# Altium schematic sheet POWER.SchDoc
size A2; SheetNumber: 1; SheetTotal: 6; SPICEModelCacheZVIZADMF: <root> / <DocumentId>ZVIZADMF</DocumentId> / </root>
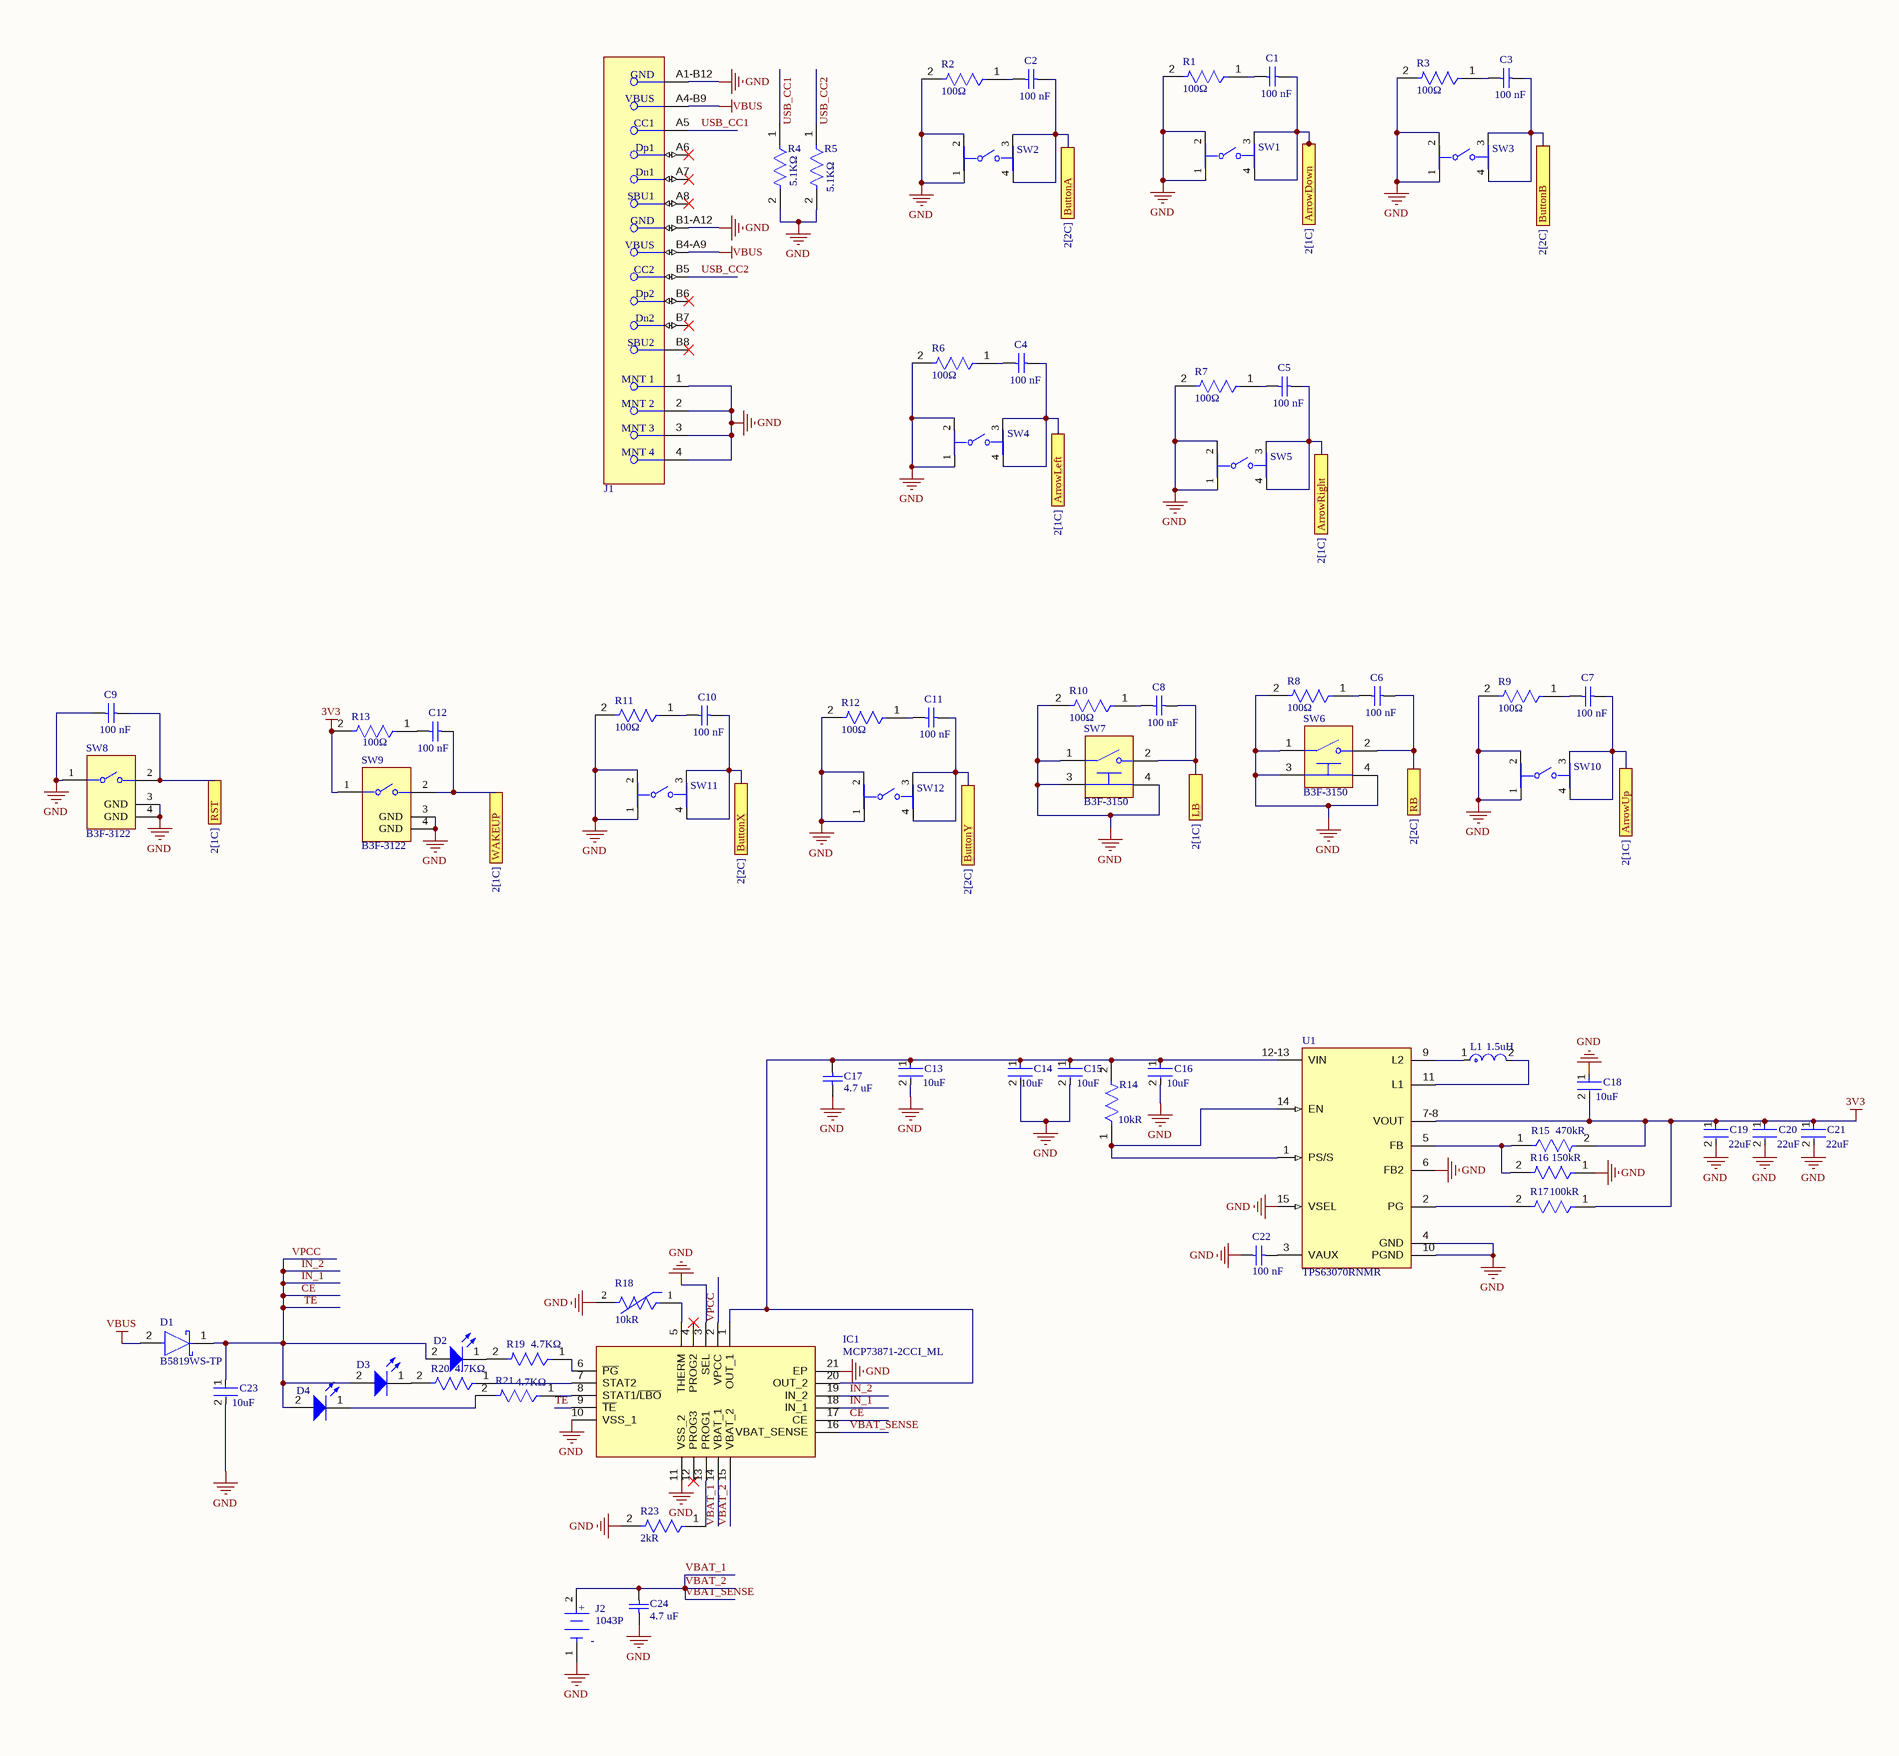
[diagram p0: POWER.SchDoc, left]
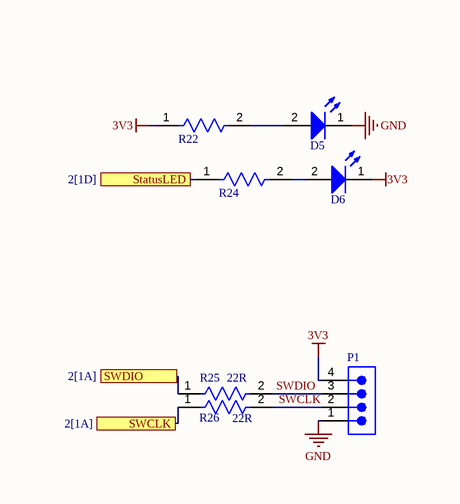
[diagram p1: POWER.SchDoc, right]

## Parts
C1  value 100 nF  [CAPC2013X145X50LL20T25]  (hidden comment: C0805C104K9RACTU)
C2  value 100 nF  [CAPC2013X145X50LL20T25]  (hidden comment: C0805C104K9RACTU)
C3  value 100 nF  [CAPC2013X145X50LL20T25]  (hidden comment: C0805C104K9RACTU)
C4  value 100 nF  [CAPC2013X145X50LL20T25]  (hidden comment: C0805C104K9RACTU)
C5  value 100 nF  [CAPC2013X145X50LL20T25]  (hidden comment: C0805C104K9RACTU)
C6  value 100 nF  [CAPC2013X145X50LL20T25]  (hidden comment: C0805C104K9RACTU)
C7  value 100 nF  [CAPC2013X145X50LL20T25]  (hidden comment: C0805C104K9RACTU)
C8  value 100 nF  [CAPC2013X145X50LL20T25]  (hidden comment: C0805C104K9RACTU)
C9  value 100 nF  [CAPC2013X145X50LL20T25]  (hidden comment: C0805C104K9RACTU)
C10  value 100 nF  [CAPC2013X145X50LL20T25]  (hidden comment: C0805C104K9RACTU)
C11  value 100 nF  [CAPC2013X145X50LL20T25]  (hidden comment: C0805C104K9RACTU)
C12  value 100 nF  [CAPC2013X145X50LL20T25]  (hidden comment: C0805C104K9RACTU)
C13  Capacitance: 10uF  [FP-CL21-IPC_C]  (hidden comment: CL21A106MPFNNNF)
C14  Capacitance: 10uF  [FP-CL21-IPC_C]  (hidden comment: CL21A106MPFNNNF)
C15  Capacitance: 10uF  [FP-CL21-IPC_C]  (hidden comment: CL21A106MPFNNNF)
C16  Capacitance: 10uF  [FP-CL21-IPC_C]  (hidden comment: CL21A106MPFNNNF)
C17  value 4.7 uF  [CAPC2013X145X50NL20T25]  (hidden comment: C0805C475K9PACTU)
C18  Capacitance: 10uF  [FP-CL21-IPC_C]  (hidden comment: CL21A106MPFNNNF)
C19  Capacitance: 22uF  [FP-CL21-IPC_B]  (hidden comment: CL21A226MQCLQNC)
C20  Capacitance: 22uF  [FP-CL21-IPC_B]  (hidden comment: CL21A226MQCLQNC)
C21  Capacitance: 22uF  [FP-CL21-IPC_B]  (hidden comment: CL21A226MQCLQNC)
C22  value 100 nF  [CAPC1005X56X25LL10T15]  (hidden comment: 0402ZD104JAT2A)
C23  Capacitance: 10uF  [FP-CL21-IPC_C]  (hidden comment: CL21A106MPFNNNF)
C24  value 4.7 uF  [CAPC2013X145X50NL20T25]  (hidden comment: C0805C475K9PACTU)
D1  B5819WS-TP  [FP-SOD-323-IPC_C]
D2  150080BS75000  [WL-SMCW_0805_150080xx75000]  (value not drawn)
D3  150080BS75000  [WL-SMCW_0805_150080xx75000]  (value not drawn)
D4  150080BS75000  [WL-SMCW_0805_150080xx75000]  (value not drawn)
D5  150080BS75000  [WL-SMCW_0805_150080xx75000]  (value not drawn)
D6  150080BS75000  [WL-SMCW_0805_150080xx75000]  (value not drawn)
IC1  MCP73871-2CCI_ML  [QFN50P400X400X100-21N-D]
J1  USB4105-GF-A  [FP-USB4105-GF-A-MFG]  (value not drawn)
J2  1043P  [FP-1043P-MFG]
L1  Inductance: 1.5uH  [FP-XFL4020-MFG]  (hidden comment: XFL4020-152MEC)
P1  TSW-104-08-L-S  [SMTC-TSW-104-08-X-S]  (value not drawn)
R1  value 100Ω  [FP-AC0805-MFG]  (hidden comment: AC0805JR-07100RL)
R2  value 100Ω  [FP-AC0805-MFG]  (hidden comment: AC0805JR-07100RL)
R3  value 100Ω  [FP-AC0805-MFG]  (hidden comment: AC0805JR-07100RL)
R4  value 5.1KΩ  [FP-RT0805-MFG]  (hidden comment: RT0805DRE075K1L)
R5  Resistance: 5.1KΩ  [FP-RT0805-MFG]  (hidden comment: RT0805DRE075K1L)
R6  value 100Ω  [FP-AC0805-MFG]  (hidden comment: AC0805JR-07100RL)
R7  value 100Ω  [FP-AC0805-MFG]  (hidden comment: AC0805JR-07100RL)
R8  value 100Ω  [FP-AC0805-MFG]  (hidden comment: AC0805JR-07100RL)
R9  value 100Ω  [FP-AC0805-MFG]  (hidden comment: AC0805JR-07100RL)
R10  value 100Ω  [FP-AC0805-MFG]  (hidden comment: AC0805JR-07100RL)
R11  value 100Ω  [FP-AC0805-MFG]  (hidden comment: AC0805JR-07100RL)
R12  value 100Ω  [FP-AC0805-MFG]  (hidden comment: AC0805JR-07100RL)
R13  value 100Ω  [FP-AC0805-MFG]  (hidden comment: AC0805JR-07100RL)
R14  Resistance: 10kR  [FP-CRCW1206-e3-IPC_C]  (hidden comment: CRCW120610K0FKEA)
R15  Resistance: 470kR  [FP-CR0805-IPC_A]  (hidden comment: CR0805-JW-474GLF)
R16  Resistance: 150kR  [FP-MCU0805-IPC_B]  (hidden comment: MCU08050C1503FP500)
R17  Resistance: 100kR  [FP-CR0805-MFG]  (hidden comment: CR0805-JW-104GLF)
R18  Resistance: 10kR  [FP-ERTJ1-MFG]  (hidden comment: ERT-J1VG103FA)
R19  value 4.7KΩ  [FP-RT0805-MFG]  (hidden comment: RT0805DRE074K7L)
R20  value 4.7KΩ  [FP-RT0805-MFG]  (hidden comment: RT0805DRE074K7L)
R21  value 4.7KΩ  [FP-RT0805-MFG]  (hidden comment: RT0805DRE074K7L)
R22  RT0805CRE075K1L  [FP-RT0805-MFG]  (value not drawn)
R23  Resistance: 2kR  [FP-MCR10-MFG]  (hidden comment: MCR10EZHJ202)
R24  RT0805CRE075K1L  [FP-RT0805-MFG]  (value not drawn)
R25  Resistance: 22R  [FP-RG2012-IPC_B]  (hidden comment: RG2012Q-220-D-T5)
R26  Resistance: 22R  [FP-RG2012-IPC_B]  (hidden comment: RG2012Q-220-D-T5)
SW1  1241.1612.23  [FP-1241_1612_23-MFG]  (value not drawn)
SW2  1241.1612.23  [FP-1241_1612_23-MFG]  (value not drawn)
SW3  1241.1612.23  [FP-1241_1612_23-MFG]  (value not drawn)
SW4  1241.1612.23  [FP-1241_1612_23-MFG]  (value not drawn)
SW5  1241.1612.23  [FP-1241_1612_23-MFG]  (value not drawn)
SW6  B3F-3150  [FP-B3F-3150-MFG]
SW7  B3F-3150  [FP-B3F-3150-MFG]
SW8  B3F-3122  [FP-B3F-3122-MFG]
SW9  B3F-3122  [FP-B3F-3122-MFG]
SW10  1241.1612.23  [FP-1241_1612_23-MFG]  (value not drawn)
SW11  1241.1612.23  [FP-1241_1612_23-MFG]  (value not drawn)
SW12  1241.1612.23  [FP-1241_1612_23-MFG]  (value not drawn)
U1  TPS63070RNMR  [FP-RNM0015A-MFG]

## Ports
ArrowDown (see 2[1C]), ArrowLeft (see 2[1C]), ArrowRight (see 2[1C]), ArrowUp (see 2[1C]), ButtonA (see 2[2C]), ButtonB (see 2[2C]), ButtonX (see 2[2C]), ButtonY (see 2[2C]), LB (see 2[1C]), RB (see 2[2C]), RST (see 2[1C]), StatusLED (see 2[1D]), SWCLK (see 2[1A]), SWDIO (see 2[1A]), WAKEUP (see 2[1C])

## Nets
3V3: C18.2 C19.1 C20.1 C21.1 D6.1(K) P1.4 R13.2 R15.2 R17.1 R22.1 SW9.1 U1.7-8(VOUT)
GND: C9.1 C13.2 C14.2 C15.2 C16.2 C17.1 C18.1 C19.2 C20.2 C21.2 C22.2 C23.2 C24.1 D5.1(K) IC1.3(SEL) IC1.10(VSS_1) IC1.11(VSS_2) IC1.21(EP) J1.1(MNT_1) J1.2(MNT_2) J1.3(MNT_3) J1.4(MNT_4) J1.A1-B12(GND) J1.B1-A12(GND) J2.1(C) P1.1 R1.2 R2.2 R3.2 R4.2 R5.2 R6.2 R7.2 R8.2 R9.2 R10.2 R11.2 R12.2 R16.1 R18.2 R23.2 SW1.1 SW1.2 SW2.1 SW2.2 SW3.1 SW3.2 SW4.1 SW4.2 SW5.1 SW5.2 SW6.1 SW6.3(MNT_1) SW6.4(MNT_2) SW7.1 SW7.3(MNT_1) SW7.4(MNT_2) SW8.1 SW8.3(GND) SW8.4(GND) SW9.3(GND) SW9.4(GND) SW10.1 SW10.2 SW11.1 SW11.2 SW12.1 SW12.2 U1.4(GND) U1.6(FB2) U1.10(PGND) U1.15(VSEL)
VBUS: D1.2(A) J1.A4-B9(VBUS) J1.B4-A9(VBUS)
ArrowDown: C1.2 SW1.3 SW1.4 ; port ArrowDown
ArrowLeft: C4.2 SW4.3 SW4.4 ; port ArrowLeft
ArrowRight: C5.2 SW5.3 SW5.4 ; port ArrowRight
ArrowUp: C7.2 SW10.3 SW10.4 ; port ArrowUp
ButtonA: C2.2 SW2.3 SW2.4 ; port ButtonA
ButtonB: C3.2 SW3.3 SW3.4 ; port ButtonB
ButtonX: C10.2 SW11.3 SW11.4 ; port ButtonX
ButtonY: C11.2 SW12.3 SW12.4 ; port ButtonY
CE: C23.1 D1.1(C) D2.2(A) D3.2(A) D4.2(A) IC1.2(VPCC) IC1.9(~{TE}) IC1.17(CE) IC1.18(IN_1) IC1.19(IN_2)  [also labelled IN_1, IN_2, TE, VPCC]
LB: C8.2 SW7.2 ; port LB
RB: C6.2 SW6.2 ; port RB
RST: C9.2 SW8.2 ; port RST
StatusLED: R24.1 ; port StatusLED
SWCLK: P1.2 R26.2
SWCLK: R26.1 ; port SWCLK  [a separate net that carries the same name]
SWDIO: P1.3 R25.2
SWDIO: R25.1 ; port SWDIO  [a separate net that carries the same name]
USB_CC1: J1.A5(CC1) R4.1
USB_CC2: J1.B5(CC2) R5.1
VBAT_1: C24.2 IC1.14(VBAT_1) IC1.15(VBAT_2) IC1.16(VBAT_SENSE) J2.2(A)  [also labelled VBAT_2, VBAT_SENSE]
WAKEUP: C12.2 SW9.2 ; port WAKEUP
NetC1_1: C1.1 R1.1
NetC2_1: C2.1 R2.1
NetC3_1: C3.1 R3.1
NetC4_1: C4.1 R6.1
NetC5_1: C5.1 R7.1
NetC6_1: C6.1 R8.1
NetC7_1: C7.1 R9.1
NetC8_1: C8.1 R10.1
NetC10_1: C10.1 R11.1
NetC11_1: C11.1 R12.1
NetC12_1: C12.1 R13.1
NetC13_1: C13.1 C14.1 C15.1 C16.1 C17.2 IC1.1(OUT_1) IC1.20(OUT_2) R14.2 U1.12-13(VIN)
NetC22_1: C22.1 U1.3(VAUX)
NetD2_1: D2.1(K) R19.2
NetD3_1: D3.1(K) R20.2
NetD4_1: D4.1(K) R21.2
NetD5_2: D5.2(A) R22.2
NetD6_2: D6.2(A) R24.2
NetIC1_5: IC1.5(THERM) R18.1
NetIC1_6: IC1.6(~{PG}) R19.1
NetIC1_7: IC1.7(STAT2) R20.1
NetIC1_8: IC1.8(STAT1/~{LBO}) R21.1
NetIC1_13: IC1.13(PROG1) R23.1
NetL1_1: L1.1 U1.9(L2)
NetL1_2: L1.2 U1.11(L1)
NetR14_1: R14.1 U1.1(PS/S) U1.14(EN)
NetR15_1: R15.1 R16.2 U1.5(FB)
NetR17_2: R17.2 U1.2(PG)

Not connected (* = marked no-connect by the designer): IC1 4(PROG2)* 12(PROG3)*; J1 A6(Dp1)* A7(Dn1)* A8(SBU1)* B6(Dp2)* B7(Dn2)* B8(SBU2)*

## Notes on the sheet
- DWG NO:
- REV:
- THIS DOCUMENT AND THE DATA DISCLOSED HEREIN OR
- HEREWITH IS THE PROPERTY OF ALTIUM LIMITED AND MAY
- BE FREELY DISTRIBUTED IN WHOLE. NO RIGHTS ARE
- RESERVED OR EXPRESS OR IMPLIED WARANTEE GIVEN.
- REVISION
- DESCRIPTION
- DATE
- APPROVED
- ENG:
- APPROVALS
- PROJECT
- DSN:
- CHK:
- REFERENCE DOCUMENTS
- PROJECT REVISION:
- TITLE
- DOCUMENT REVISION:
- DESIGN ITEM:
- BOM:
- FAB DWG:
- PCB DWG:
- ASSY DWG:
- SCALE:
- A2
- SIZE
- CAGE CODE
- FILE NAME
- DWG NO.
- SHEET
- OF
- REV
- (in symbol CMP-19636-000034-1) +

## Library data of the parts
C1-C12 = CMP-1036-04391-2: Manufacturer: Kemet; Part Number: C0805C104K9RACTU
C13-C16 C18 C23 = CMP-13271-002245-1: CL21 Series 0805 10uF 10V ±20% Tolerance X5R Multilayer Ceramic Chip Capacitor; Voltage Rating (DC): 10V; Mount: Surface Mount; Tolerance: 20%; Case/Package: 0805; Voltage Rating: 10V; Dielectric: X5R; Max Operating Temperature: 85°C; Packaging: Tape and Reel; Height: 1.25mm; Thickness: 0.053inch; Width: 0.049inch; Length: 2mm; Radiation Hardening: No; Min Operating Temperature: -55°C; Depth: 1.25mm; Package Quantity: 10000
C17 C24 = CMP-2007-01009-1: Manufacturer: Kemet; Part Number: C0805C475K9PACTU
C19-C21 = CMP-13271-001454-1: CL21 Series 0805 22uF 6.3V ±20% Tolerance X5R Multilayer Ceramic Chip Capacitor; Mount: Surface Mount; Voltage Rating: 6.3V; Radiation Hardening: No; Thickness: 0.037inch; Packaging: Tape and Reel; Width: 0.049inch; Tolerance: 20%; Case Code (Imperial): 0805; Dielectric: X5R; Case Code (Metric): 2012; Package Quantity: 1; Lead Free: Lead Free; Case/Package: 0805; Min Operating Temperature: -55°C; Depth: 1.25mm; Length: 2mm; Height: 0.85mm; Max Operating Temperature: 85°C
C22 = CMP-2008-02899-1: Manufacturer: AVX Interconnect / Elco; Part Number: 0402ZD104JAT2A
D1 = CMP-56206-000009-1: DIODE SCHOTTKY 40V 1A SOD323; Max Reverse Leakage Current: 1mA; Peak Non-Repetitive Surge Current: 10A; Forward Voltage: 900mV; Element Configuration: Single; Max Reverse Voltage (DC): 40V; Number of Pins: 2; Max Operating Temperature: 125°C; Package Quantity: 1; Radiation Hardening: No; Average Rectified Current: 1A; Lead Free: Lead Free; Series: -; Mount: Surface Mount; Min Operating Temperature: -65°C; RoHS Compliant: Yes; Packaging: Tape and Reel; Max Surge Current: 10A
D2-D6 = CMP-1426-00008-7: Led, Blue, 470 Nm, 3.2 V, 30 Ma, 145 Mcd Rohs Compliant: Yes; Dominant Wavelength: 470nm; Max Junction Temperature (Tj): 95°C; Power Dissipation: 105mW; Peak Wavelength: 465nm; Max Reverse Voltage (DC): 5V; Forward Current: 100mA; Test Current: 20mA; Luminous Intensity: 145mcd; Lens Style: Clear, Rectangular; Viewing Angle: 140°; Forward Voltage: 3.2V; Color: Blue; Height: 700µm; Case Code (Imperial): 0805; Width: 1.25mm; REACH SVHC: Unknown; Case/Package: 0805; Lead Free: Lead Free; Mount: Surface Mount; Packaging: Tape and Reel; RoHS: Compliant; Reverse Voltage: 5V; Min Operating Temperature: -40°C; Case Code (Metric): 2012; Wavelength: 470nm; Max Operating Temperature: 85°C; Length: 2mm
IC1 = MCP73871-2CCI_ML: Integrated Circuit; Manufacturer_Name: Microchip; Manufacturer_Part_Number: MCP73871-2CCI/ML; Datasheet Link: https://datasheet.datasheetarchive.com/originals/distributors/Datasheets-DGA15/728881.pdf; Height: 1mm; Mouser Part Number: 579-MCP73871-2CCI/ML; Mouser Price/Stock: https://www.mouser.co.uk/ProductDetail/Microchip-Technology/MCP73871-2CCI-ML?qs=qXsUupcbpXyQfJ2clznZxw%3D%3D; Arrow Part Number: MCP73871-2CCI/ML; Arrow Price/Stock: https://www.arrow.com/en/products/mcp73871-2cciml/microchip-technology?utm_currency=USD&region=nac
J1 = CMP-245163-000001-1: CONN RCPT USB2.0 TYPEC 5A; Manufacturer: GCT; Voltage Rating: 20V; Is Female: yes; Current Rating: 5/6.25/1.25/0.25A; Number Of Contacts: 16; Conn Orientation: Right Angle; Device Class L1: Connectors; Category: Conn; Lead Free: Yes; RoHS: TRUE; Temperature Range High: +85°C; Digikey Description: CONN RCPT USB2.0 TYPEC 5A; Device Class L3: unset; ComponentLink2Description: Datasheet; Manufacturer Part Number: USB4105-GF-A; Package: 0; Usb Standard: USB 2.0; Device Class L2: USB Connectors; Automotive: No; Temperature Range Low: -40°C; Height: 3.46mm; Temperature: -40°C to +85°C; Contact Material: Gold,Nickel; ComponentLink2URL: https://gct.co/files/drawings/usb4105.pdf; Octopart: https://octopart.com/usb4105-gf-a-gct-106627878
J2 = CMP-19636-000034-1: BATT HOLDER 18650 1 CELL PC PIN; Number of Cells: 1; Series: -; Termination: PC Pin; Package Quantity: 50; Min Operating Temperature: -50°C; Mount: Through Hole; Packaging: Tray; Max Operating Temperature: 145°C
L1 = CMP-11268-000104-1: Inductor Power Shielded Wirewound 1.5uH 20% 100KHz 9.1A 15.8mOhm DCR 1515 Automotive Embossed Plastic T/R; Core Material: Composite; DC Resistance (DCR): 15.8mR; Saturation Current: 4.1A; Self Resonant Frequency: 59MHz; Tolerance: 20%; Max DC Current: 9.1A; RoHS Compliant: Yes; Max Operating Temperature: 125°C; Length: 4.3mm; Case/Package: SMD/SMT; Mount: Surface Mount; Shielding: Shielded; Min Operating Temperature: -40°C; RMS Current (Irms): 9.1A; Test Frequency: 100kHz; Inductance Tolerance: 20%; REACH SVHC: No SVHC; Packaging: Tape and Reel; Termination: SMD/SMT; Lead Free: Contains Lead; Width: 4.3mm; Series: XFL4020; Height: 2.1mm
P1 = CMP-1024-00358-1: 0.025" SQ Post Header, Through-hole, Vertical, -55 to 125 degC, 2.54 mm Pitch, 4-Pin, Male, RoHS; Manufacturer: Samtec; Pitch: 2.54 mm; PartNumber: TSW-104-08-L-S; RoHS: True; Temperature Range: -55 to 125 degC; PackageDescription: .025[0.64] SQ. Post Terminal Strip Assembly; Orientation: Vertical; ComponentLink2URL: http://www.samtec.com/documents/webfiles/pdf/TSW_TH.PDF; ComponentLink1Description: Manufacturer URL; ComponentLink2Description: Datasheet; PackageVersion: DM, 8/1988; ComponentLink3URL: http://www.samtec.com/documents/webfiles/cpdf/TSW-XXX-XX-XXX-X-XX-XXX-MKT.pdf; Mounting Technology: Through-hole; PackageReference: TSW-104-08-X-S; ComponentLink3Description: Package Specification; ComponentLink1URL: http://www.samtec.com; DatasheetVersion: F-214
R1-R3 R6-R13 = CMP-03412-037659-1: RES SMD 100 OHM 5% 1/8W 0805; Manufacturer: Yageo; Voltage Rating: 150V; Automotive Grade: Grade 0; Tolerance: 0.05; Temperature: -55°C to +155°C; Height: 0.6mm; Series: AC; Manufacturer Part Number: AC0805JR-07100RL; Digikey Description: RES SMD 100 OHM 5% 1/8W 0805; ComponentLink2URL: http://www.yageo.com/documents/recent/PYu-AC_51_RoHS_L_6.pdf; ComponentLink2Description: Datasheet; Ipc Land Pattern Name: RESC200125X50; Lead Free: Yes; Package: AC0805; Resistance: 100Ω; Device Class L2: Resistors; Composition: Thick Film; Temperature Range Low: -55°C; Temperature Range High: +155°C; RoHS: TRUE; Mouser Description: Thick Film Resistors - SMD 1/8W 100ohm 5% AEC-Q200; Automotive: Yes; Device Class L1: Passive Components; Power Rating: 1/8W; Category: Res; Octopart: https://octopart.com/ac0805jr-07100rl-yageo-30510952; Device Class L3: Chip SMD Resistors; Footprint Url: http://www.yageo.com/exep/pages/download/literatures/PYu-R_Mount_10.pdf
R4 = CMP-03412-022555-1: RES SMD 5.1K OHM 0.5% 1/8W 0805; Manufacturer: Yageo; Temperature Coefficient: 50 ppm/°C; Tolerance: 0.01; Voltage Rating: 150V; Power Rating: 0.125W; Manufacturer Part Number: RT0805DRE075K1L; Device Class L3: Chip SMD Resistors; Digikey Description: RES SMD 5.1K OHM 0.5% 1/8W 0805; Series: RT; ComponentLink2URL: http://www.yageo.com/documents/recent/PYu-RT_1-to-0.01_RoHS_L_9.pdf; Lead Free: Yes; Octopart: https://octopart.com/rt0805dre075k1l-yageo-1467682; ComponentLink2Description: Datasheet; Temperature Range High: +155°C; Temperature Range Low: -55°C; Resistance: 5.1KΩ; Composition: Thin Film; Height: 0.6mm; Device Class L2: Resistors; Ipc Land Pattern Name: RESC200125X50; Package: RT0805; Category: Res; Footprint Url: http://www.yageo.com/exep/pages/download/literatures/PYu-R_Mount_10.pdf; Temperature: -55°C to +155°C; RoHS: TRUE; Automotive: No; Device Class L1: Passive Components
R5 = CMP-03412-022555-1: RES SMD 5.1K OHM 0.5% 1/8W 0805; Manufacturer: Yageo; Temperature Coefficient: 50 ppm/°C; Value: 5.1KΩ; Tolerance: 0.01; Voltage Rating: 150V; Power Rating: 0.125W; Manufacturer Part Number: RT0805DRE075K1L; Device Class L3: Chip SMD Resistors; Digikey Description: RES SMD 5.1K OHM 0.5% 1/8W 0805; Series: RT; ComponentLink2URL: http://www.yageo.com/documents/recent/PYu-RT_1-to-0.01_RoHS_L_9.pdf; Lead Free: Yes; Octopart: https://octopart.com/rt0805dre075k1l-yageo-1467682; ComponentLink2Description: Datasheet; Temperature Range High: +155°C; Temperature Range Low: -55°C; Composition: Thin Film; Height: 0.6mm; Device Class L2: Resistors; Ipc Land Pattern Name: RESC200125X50; Package: RT0805; Category: Res; Footprint Url: http://www.yageo.com/exep/pages/download/literatures/PYu-R_Mount_10.pdf; Temperature: -55°C to +155°C; RoHS: TRUE; Automotive: No; Device Class L1: Passive Components
R14 = CMP-2003-04807-2: RES Thick Film, 10kΩ, 1%, 0.25W, 100ppm/°C, 1206; Working Voltage: 200V; Max Power Dissipation: 250mW; Tolerance: 1%; Width: 0.063inch; Height: 0.55mm; Number of Pins: 2; Voltage Rating: 200V; Temperature Coefficient: 100ppm/°C; Military Standard: Not; Features: Automotive AEC-Q200; Depth: 1.6mm; Radiation Hardening: No; Termination: SMD/SMT; Case Code (Imperial): 1206; Weight: 0.000353oz; Length: 3.2mm; Package Quantity: 10; Voltage Rating (DC): 200V; Case/Package: 1206; Min Operating Temperature: -55°C; Number of Terminations: 2; Composition: Thick Film; Contact Plating: Tin; Power Rating: 250mW; Packaging: Tape and Reel; Max Operating Temperature: 155°C; Lead Free: Lead Free; Case Code (Metric): 3216
R15 = CMP-07231-006605-1: Thick Film Chip Resistors 0805 470kΩ 0.125W 5% 200ppm/°C; Max Power Dissipation: 125mW; Voltage Rating: 150V; Radiation Hardening: No; Construction: Rectangular; Width: 0.049inch; Termination: SMD/SMT; Packaging: Tape and Reel; Min Operating Temperature: -55°C; Series: CR0805; Contact Plating: Tin; Tolerance: 5%; Power Rating: 125mW; Weight: 0.000194oz; Number of Terminations: 2; Package Quantity: 10000; Max Operating Temperature: 155°C; Case Code (Metric): 2012; Case/Package: 0805; Features: Moisture Resistant; Temperature Coefficient: 200ppm/°C; Depth: 1.25mm; Mount: Surface Mount; Thickness: 508um; Military Standard: Not; Length: 2mm; Case Code (Imperial): 0805; Height: 0.024inch; Resistor Type: Thick Film
R16 = CMP-02407-003613-1: RES 1.05K OHM 0.5% 1/5W 0805; Max Power Dissipation: 200mW; Temperature Coefficient: 50ppm/°C; Tolerance: 1%; Military Standard: Not; Packaging: Tape and Reel; Length: 0.079inch; Max Operating Temperature: 125°C; Case/Package: 0805; Min Operating Temperature: -55°C; Width: 0.049inch; Composition: Thin Film; Number of Terminations: 2; Radiation Hardening: No; Package Quantity: 5000; Lead Free: Lead Free; Contact Plating: Tin; Depth: 1.25mm; Height: 0.022inch
R17 = CMP-07231-001707-1: Thick Film Chip Resistors 0805 100kΩ 0.125W 5% 200ppm/°C; Power Rating: 125mW; Voltage Rating: 150V; Case Code (Metric): 2012; Case Code (Imperial): 0805; Temperature Coefficient: 200ppm/°C; Mount: Surface Mount; Tolerance: 5%; Radiation Hardening: No; Military Standard: Not; Contact Plating: Tin; Number of Terminations: 2; Packaging: Tape and Reel; Thickness: 508um; Length: 0.079inch; Depth: 1.25mm; Min Operating Temperature: -55°C; Features: Moisture Resistant; Max Operating Temperature: 155°C; Width: 0.049inch; Package Quantity: 10000; Termination: SMD/SMT; Composition: Thick Film; Max Power Dissipation: 125mW; Height: 0.024inch; Case/Package: 0805
R18 = CMP-05419-000001-1: THERMISTOR NTC 10KOHM 3380K 0603; Max Power Dissipation: 100mW; Resistance Tolerance: 1%; Case Code (Imperial): 0603; Height: 0.8mm; Case/Package: 0603; Depth: 0.8mm; Min Operating Temperature: -40°C; Accuracy: 1%; Series: ERT-J; Termination: SMD/SMT; Length: 1.6mm; Number of Pins: 2; Lead Free: Lead Free; Power Rating: 100mW; Package Quantity: 4000; RoHS Compliant: Yes; Max Operating Temperature: 125°C; Width: 800um; REACH SVHC: No SVHC; Packaging: Tape and Reel; Tolerance: 1%; Mount: Surface Mount; Case Code (Metric): 1608; Radiation Hardening: No
R19-R21 = CMP-03412-005354-1: RES SMD 4.7K OHM 0.5% 1/8W 0805; Manufacturer: Yageo; Power Rating: 0.125W; Tolerance: 0.01; Voltage Rating: 150V; Temperature Coefficient: 50 ppm/°C; Lead Free: Yes; Device Class L2: Resistors; ComponentLink2Description: Datasheet; RoHS: TRUE; Package: RT0805; Resistance: 4.7KΩ; Device Class L3: Chip SMD Resistors; Ipc Land Pattern Name: RESC200125X50; Category: Res; Octopart: https://octopart.com/rt0805dre074k7l-yageo-1242027; Temperature: -55°C to +155°C; Temperature Range High: +155°C; Digikey Description: RES SMD 4.7K OHM 0.5% 1/8W 0805; Series: RT; Height: 0.6mm; Footprint Url: http://www.yageo.com/exep/pages/download/literatures/PYu-R_Mount_10.pdf; Device Class L1: Passive Components; Temperature Range Low: -55°C; Composition: Thin Film; Manufacturer Part Number: RT0805DRE074K7L; ComponentLink2URL: http://www.yageo.com/documents/recent/PYu-RT_1-to-0.01_RoHS_L_9.pdf; Automotive: No
R22 R24 = CMP-03412-005622-1: RES SMD 5.1K OHM 0.25% 1/8W 0805; Manufacturer: Yageo; Tolerance: 0.005; Value: 5.1KΩ; Voltage Rating: 150V; Power Rating: 0.125W; Temperature Coefficient: 50 ppm/°C; Temperature Range Low: -55°C; Device Class L3: Chip SMD Resistors; Series: RT; Automotive: No; Height: 0.6mm; Lead Free: Yes; Category: Res; ComponentLink2Description: Datasheet; ComponentLink2URL: http://www.yageo.com/documents/recent/PYu-RT_1-to-0.01_RoHS_L_9.pdf; Composition: Thin Film; Temperature Range High: +155°C; Device Class L1: Passive Components; Footprint Url: http://www.yageo.com/exep/pages/download/literatures/PYu-R_Mount_10.pdf; Package: RT0805; Device Class L2: Resistors; Resistance: 5.1KΩ; RoHS: TRUE; Digikey Description: RES SMD 5.1K OHM 0.25% 1/8W 0805; Temperature: -55°C to +155°C; Manufacturer Part Number: RT0805CRE075K1L; Octopart: https://octopart.com/rt0805cre075k1l-yageo-1479639; Ipc Land Pattern Name: RESC200125X50
R23 = CMP-08839-010481-1: Thick Film Chip Resistor, 0805, 2kΩ, 5%, 200ppm/°C, 0.125W, 150V; Max Power Dissipation: 125mW; Height: 0.024inch; Max Operating Temperature: 155°C; Temperature Coefficient: 200ppm/°C; Mount: Surface Mount; Contact Plating: Tin; Voltage Rating (DC): 150V; Power Rating: 125mW; Number of Terminations: 2; Case Code (Metric): 2012; Package Quantity: 5000; Size Code: 0805; Lead Free: Lead Free; Case Code (Imperial): 0805; Tolerance: 5%; Resistor Type: Thick Film; Width: 0.049inch; Length: 0.079inch; Case/Package: 0805; Packaging: Tape and Reel; Radiation Hardening: No; Series: MCR10; Min Operating Temperature: -55°C; RoHS Compliant: Yes
R25 R26 = CMP-28537-003551-1: Automotive Metal Thin Film Chip Resistor, 0805, 22Ω, 0.5%, 50ppm/°C, 0.125W, 150V; Power Rating: 125mW; Length: 2mm; Features: Automotive AEC-Q200; Tolerance: 0.5%; Packaging: Tape and Reel; Case/Package: 0805; Termination: SMD/SMT; Weight: 0.000194oz; Height: 0.4mm; Voltage Rating (DC): 150V; Voltage Rating: 150V; RoHS Compliant: Yes; Case Code (Imperial): 0805; Lead Free: Lead Free; Min Operating Temperature: -55°C; Resistor Type: Thin Film; Series: RG; Max Power Dissipation: 125mW; Max Operating Temperature: 155°C; Width: 1.2mm; Temperature Coefficient: 50ppm/°C; Case Code (Metric): 2012; Number of Terminations: 2
SW1-SW5 SW10-SW12 = CMP-26321-000007-1: SWITCH TACTILE SPST-NO 0.05A 42V; Max Current Rating: 50mA; Voltage Rating (AC): 30V; Switch Function: Off-Mom; Illumination Type: Non-Illuminated; Mechanical Life: 1000000Cycles; Actuator Type: Standard; Ratings: IP40; Switch Travel: 0.35mm; Actuator Material: Polyphenylene; Operating Force: 1.6N; Throw Configuration: SPST; Contact Plating: Gold; Mount: Surface Mount; Contact Material: Gold; Termination: Gull Wing; Min Operating Temperature: -40°C; Series: SMS; Depth: 15.9mm; Radiation Hardening: No; Lead Free: Lead Free; Max Operating Temperature: 85°C; Length: 11.4mm; Voltage Rating (DC): 42V; Current Rating: 50mA; Packaging: Tape and Reel; Housing Material: Polyamide; Package Quantity: 450; Max Voltage Rating (AC): 30V; Orientation: Straight; Weight: 0.070548oz; Max Voltage Rating (DC): 42V
SW6 SW7 = CMP-08834-000006-1: SWITCH TACTILE SPST-NO 0.05A 24V; Manufacturer: Omron; Contact Current Rating: 50mA; Electromechanical Life: 1000000Cycles; Contact Resistance: 100mΩ; Operating Force: 0.98N; Octopart: https://octopart.com/b3f-3150-omron-49234; Device Class L1: Electromechanical; Device Class L2: Switches; Temperature Range Low: -25°C; Temperature Range High: +70°C; Mouser Description: Tactile Switches R/A 6X6 6.15mm BTN; Temperature: -25°C to +70°C; Voltage Rating Dc: 24V; Automotive: No; Ambient Temperature Range Low: -25°C; Ambient Temperature Range High: +70°C; Mount: Through Hole; ComponentLink2URL: https://omronfs.omron.com/en_US/ecb/products/pdf/en-b3f.pdf; RoHS: TRUE; ComponentLink2Description: Datasheet; Digikey Description: SWITCH TACTILE SPST-NO 0.05A 24V; Package: 0; Height: 7.8mm; Throw Configuration: SPST-NO; Lead Free: Yes; Device Class L3: Tactile Switches; Category: Switch; Manufacturer Part Number: B3F-3150
SW8 SW9 = CMP-08834-000053-1: SWITCH TACTILE SPST-NO 0.05A 24V; Max Current Rating: 50mA; Actuator Type: Standard; Ratings: IP00; Number of Poles: 1; Mechanical Life: 300000Cycles; Illumination Type: Non-Illuminated; Switch Function: Off-Mom; Actuator Color: Grey; Contact Resistance: 100mR; Throw Configuration: SPST; Actuator Length: 1.6mm; Switch Travel: 0.25mm; Operating Force: 1.47N; Weight: 0.25g; Voltage Rating (DC): 24V; Contact Plating: Gold; RoHS Compliant: Yes; Contact Material: Gold; Radiation Hardening: No; Packaging: Bulk; Height: 7.4mm; Min Operating Temperature: -25°C; Electrical Life: 300000Cycles; Depth: 7.85mm; Max Voltage Rating (DC): 24V; Mount: Through Hole; Width: 6.25mm; Current Rating: 50mA; Lead Free: Lead Free; Max Operating Temperature: 70°C; Series: B3F; Contact Current Rating: 50mA; Package Quantity: 1000; Termination: PC Pins; Orientation: Right Angle; Length: 7.3mm
U1 = CMP-04918-000001-1: IC REG BCK BST ADJ 2A 15VQFN; Manufacturer Part Number: TPS63070RNMT; Manufacturer: Texas Instruments; Number Of Outputs: 1; Max Duty Cycle: 100%; Output Type: AdjustableProgrammable; Max Supply Voltage: 16V; Max Junction Temp: +125°C; Switching Topology: Buck-Boost; Output Voltage: 2.5-9V; Standoff Height: 0mm; Min Supply Voltage: 2V; Switching Frequency: 2400kHz; Nominal Supply Current: 5-54uA; Temperature: -40°C to +125°C; Device Class L1: Integrated Circuits (ICs); RoHS: TRUE; Package: RNM0015A; Octopart: https://octopart.com/tps63070rnmt-texas+instruments-75117739; Output Current: 2A; Device Class L3: Voltage Regulators - Switching; Temperature Range High: +125°C; ComponentLink2Description: Datasheet; ComponentLink2URL: http://www.ti.com/lit/ds/symlink/tps63070.pdf; Lead Free: Yes; Device Class L2: Power Management ICs; Automotive: No; Height: 1mm; Temperature Range Low: -40°C; Category: IC; Digikey Description: IC REG BCK BST ADJ 2A 15VQFN